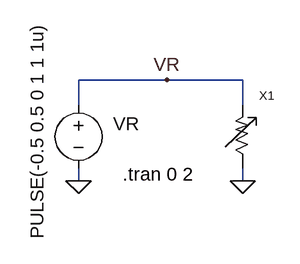
[diagram p0: schematic mbit_test.asc]
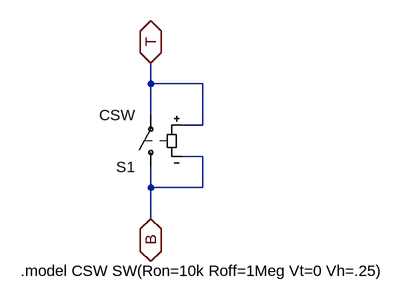
[diagram p1: sub-circuit mbit.asc]
mbit_test.asc, the LTspice schematic file:
Version 4
SHEET 1 992 688
WIRE 208 96 96 96
WIRE 304 96 208 96
WIRE 96 128 96 96
WIRE 304 128 304 96
WIRE 96 224 96 208
WIRE 304 224 304 208
FLAG 304 224 0
FLAG 96 224 0
FLAG 208 96 VR
SYMBOL mbit 304 128 R0
SYMATTR InstName X1
SYMBOL voltage 96 112 R0
WINDOW 0 44 40 Left 0
WINDOW 3 -52 186 VLeft 0
WINDOW 123 0 0 Left 0
WINDOW 39 0 0 Left 0
SYMATTR InstName VR
SYMATTR Value PULSE(-0.5 0.5 0 1 1 1u)
TEXT 152 216 Left 0 !.tran 0 2

mbit.asc, the sub-circuit schematic file:
Version 4
SHEET 1 984 680
WIRE -288 -128 -288 -160
WIRE -208 -128 -288 -128
WIRE -288 -80 -288 -128
WIRE -208 -64 -208 -128
WIRE -208 -64 -240 -64
WIRE -208 -16 -240 -16
WIRE -288 32 -288 0
WIRE -208 32 -208 -16
WIRE -208 32 -288 32
WIRE -288 80 -288 32
FLAG -288 -160 T
IOPIN -288 -160 BiDir
FLAG -288 80 B
IOPIN -288 80 BiDir
SYMBOL sw -288 16 R180
SYMATTR InstName S1
SYMATTR Value CSW
TEXT -488 160 Left 0 !.model CSW SW(Ron=10k Roff=1Meg Vt=0 Vh=.25)

The netlist it stands for:
* mbit_test.asc
XX1 VR 0 mbit
VR VR 0 PULSE(-0.5 0.5 0 1 1 1u)

* block symbol definitions
.subckt mbit T B
S1 B T T B CSW
.model CSW SW(Ron=10k Roff=1Meg Vt=0 Vh=.25)
.ends mbit

.tran 0 2
.backanno
.end